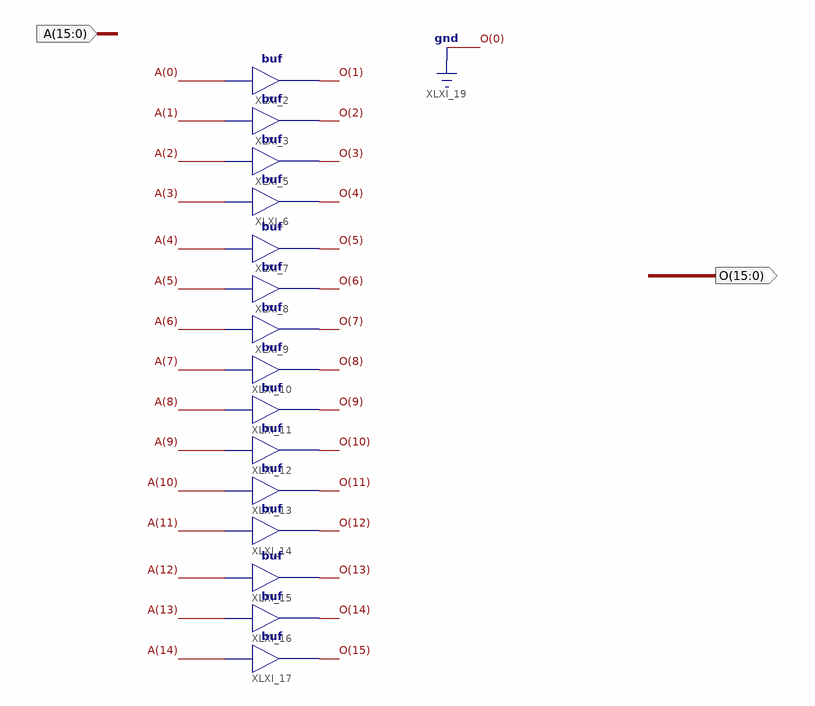
[diagram p0: schematic sheet 1]
// Xilinx ISE schematic shift1b.sch (spartan3e) as structural Verilog: 15 symbols, 2 ports
module shift1b (
  input  [15:0] A,
  output [15:0] O
);

  buf XLXI_2 (O[1], A[0]);
  buf XLXI_3 (O[2], A[1]);
  buf XLXI_5 (O[3], A[2]);
  buf XLXI_6 (O[4], A[3]);
  buf XLXI_7 (O[5], A[4]);
  buf XLXI_8 (O[6], A[5]);
  buf XLXI_9 (O[7], A[6]);
  buf XLXI_10 (O[8], A[7]);
  buf XLXI_11 (O[9], A[8]);
  buf XLXI_12 (O[10], A[9]);
  buf XLXI_13 (O[11], A[10]);
  buf XLXI_14 (O[12], A[11]);
  buf XLXI_15 (O[13], A[12]);
  buf XLXI_16 (O[14], A[13]);
  buf XLXI_17 (O[15], A[14]);

  assign O[0] = 1'b0;
endmodule
